# Altium schematic sheet ADC.SchDoc
size A; SheetNumber: 5; SheetTotal: 5
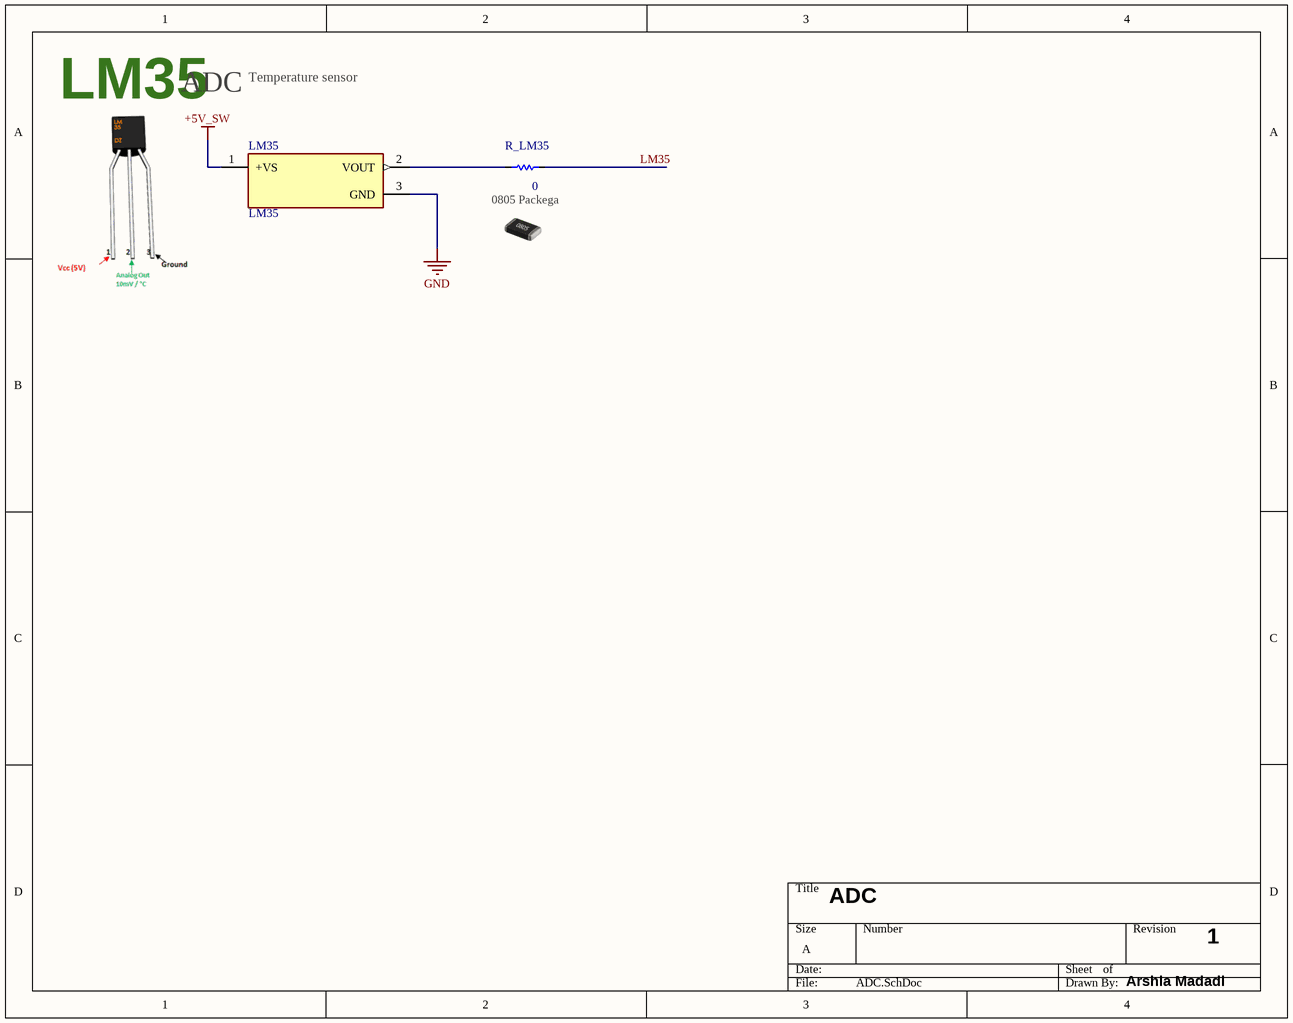
[diagram p0: ADC.SchDoc]

## Parts
LM35  LM35  [TO92127P521H735-3]
R_LM35  0  [0805]

## Nets
+5V_SW: LM35.1(+VS)
GND: LM35.3(GND)
LM35: R_LM35.2
NetLM35_2: LM35.2(VOUT) R_LM35.1

## Notes on the sheet
- ADC
- Temperature sensor
- LM35
- (near R_LM35) 0805 Packega
- 1
- Arshia Madadi

## Library data of the parts
LM35 = LM35DZ/NOPB: Temperature Sensor Analog, Local 0Â°C ~ 100Â°C 10mV/Â°C TO-92-3; MP: LM35DZ; MF: Texas Instruments; Price: None; Availability: In Stock; Package: E-PKG AXIAL-LEADED-2 ON Semiconductor; Value: *; SnapEDA_Link: https://www.snapeda.com/parts/LM35DZ/Texas+Instruments/view-part/?ref=snap; Purchase-URL: https://pricing.snapeda.com/search/part/LM35DZ/?ref=eda; Check_prices: https://www.snapeda.com/parts/LM35DZ/Texas+Instruments/view-part/?ref=eda
R_LM35 = Res: Resistor; Published: 8-Jun-2000; LatestRevisionDate: 17-Jul-2002; LatestRevisionNote: Re-released for DXP Platform.; PackageReference: AXIAL-0.3; Publisher: Altium Limited